# EAGLE design vw-lightcontrol (EAGLE 6.5.0)
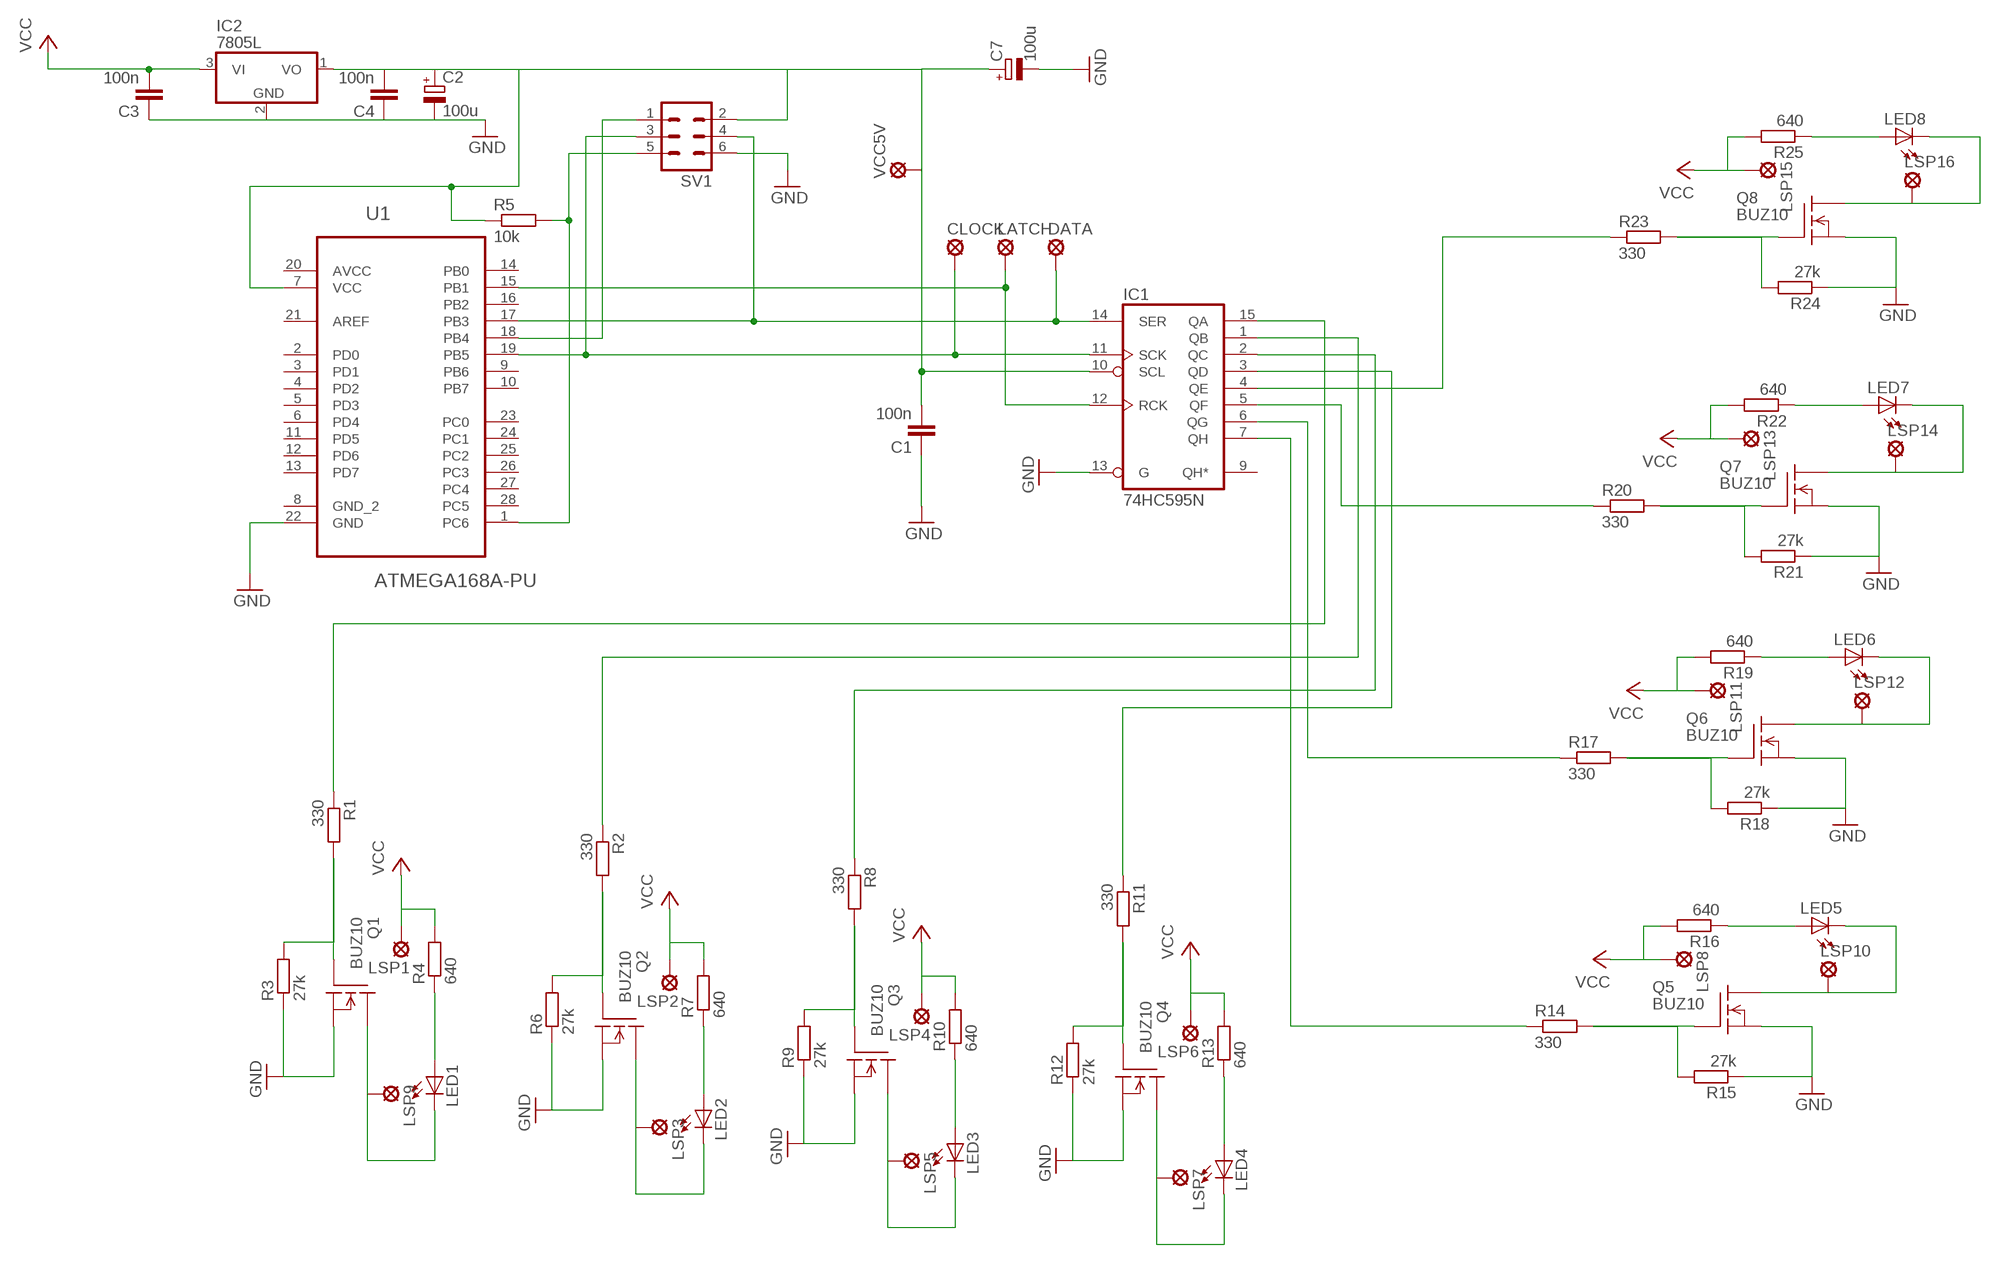
[diagram p0: schematic, sheet 1]

## Parts
C1  100n  C2.5/4  [C2.5-4]
C2  100u  CPOL-EUE2,5-6E  [E2,5-6E]
C3  100n  C2.5/4  [C2.5-4]
C4  100n  C2.5/4  [C2.5-4]
C7  100u  CPOL-EUE2,5-6E  [E2,5-6E]
CLOCK  LSP10  [LSP10]
DATA  LSP10  [LSP10]
IC1  74HC595N  [DIL16]
IC2  7805L  [TO92]
LATCH  LSP10  [LSP10]
LED1  LED3MM  [LED3MM]
LED2  LED3MM  [LED3MM]
LED3  LED3MM  [LED3MM]
LED4  LED3MM  [LED3MM]
LED5  LED3MM  [LED3MM]
LED6  LED3MM  [LED3MM]
LED7  LED3MM  [LED3MM]
LED8  LED3MM  [LED3MM]
LSP1  LSP10  [LSP10]
LSP2  LSP10  [LSP10]
LSP3  LSP10  [LSP10]
LSP4  LSP10  [LSP10]
LSP5  LSP10  [LSP10]
LSP6  LSP10  [LSP10]
LSP7  LSP10  [LSP10]
LSP8  LSP10  [LSP10]
LSP9  LSP10  [LSP10]
LSP10  LSP10  [LSP10]
LSP11  LSP10  [LSP10]
LSP12  LSP10  [LSP10]
LSP13  LSP10  [LSP10]
LSP14  LSP10  [LSP10]
LSP15  LSP10  [LSP10]
LSP16  LSP10  [LSP10]
Q1  BUZ10  [TO220]
Q2  BUZ10  [TO220]
Q3  BUZ10  [TO220]
Q4  BUZ10  [TO220]
Q5  BUZ10  [TO220]
Q6  BUZ10  [TO220]
Q7  BUZ10  [TO220]
Q8  BUZ10  [TO220]
R1  330  R-EU_0207/10  [0207/10]
R2  330  R-EU_0207/10  [0207/10]
R3  27k  R-EU_0207/10  [0207/10]
R4  640  R-EU_0207/10  [0207/10]
R5  10k  R-EU_0207/10  [0207/10]
R6  27k  R-EU_0207/10  [0207/10]
R7  640  R-EU_0207/10  [0207/10]
R8  330  R-EU_0207/10  [0207/10]
R9  27k  R-EU_0207/10  [0207/10]
R10  640  R-EU_0207/10  [0207/10]
R11  330  R-EU_0207/10  [0207/10]
R12  27k  R-EU_0207/10  [0207/10]
R13  640  R-EU_0207/10  [0207/10]
R14  330  R-EU_0207/10  [0207/10]
R15  27k  R-EU_0207/10  [0207/10]
R16  640  R-EU_0207/10  [0207/10]
R17  330  R-EU_0207/10  [0207/10]
R18  27k  R-EU_0207/10  [0207/10]
R19  640  R-EU_0207/10  [0207/10]
R20  330  R-EU_0207/10  [0207/10]
R21  27k  R-EU_0207/10  [0207/10]
R22  640  R-EU_0207/10  [0207/10]
R23  330  R-EU_0207/10  [0207/10]
R24  27k  R-EU_0207/10  [0207/10]
R25  640  R-EU_0207/10  [0207/10]
SV1  MA03-2  [MA03-2]
U1  ATMEGA168A-PU  [DIP254P762X457-28]
VCC5V  LSP10  [LSP10]

## Nets
GND: C2.- C3.1 C4.1 IC1.13(G) IC2.2(GND) Q1.3(S) Q2.3(S) Q3.3(S) Q4.3(S) Q5.3(S) Q6.3(S) Q7.3(S) Q8.3(S) R3.1 R6.1 R9.1 R12.1 R15.1 R18.1 R21.1 R24.1 SV1.6 U1.22(GND)
N$1: LED1.A R4.1
N$2: Q1.1(G) R1.2 R3.2
N$3: LED1.K(C) LSP9.MP Q1.2(D)
N$4: IC1.15(QA) R1.1
N$5: LED2.A R7.1
N$6: C3.2 IC2.3(VI) LSP1.MP LSP2.MP LSP4.MP LSP6.MP LSP8.MP LSP11.MP LSP13.MP LSP15.MP R4.2 R7.2 R10.2 R13.2 R16.2 R19.2 R22.2 R25.2 ; supply symbol labelled VCC
N$7: C1.2 C2.+ C4.2 C7.+ IC1.10(SCL) IC2.1(VO) R5.1 SV1.2 U1.7(VCC) VCC5V.MP
N$8: Q2.1(G) R2.2 R6.2
N$9: LED2.K(C) LSP3.MP Q2.2(D)
N$10: IC1.1(QB) R2.1
N$11: LED3.A R10.1
N$12: Q3.1(G) R8.2 R9.2
N$13: LED3.K(C) LSP5.MP Q3.2(D)
N$14: IC1.2(QC) R8.1
N$15: LED4.A R13.1
N$16: Q4.1(G) R11.2 R12.2
N$17: LED4.K(C) LSP7.MP Q4.2(D)
N$18: IC1.3(QD) R11.1
N$19: LED5.A R16.1
N$20: R5.2 SV1.5 U1.1(PC6)
N$21: Q5.1(G) R14.2 R15.2
N$22: DATA.MP IC1.14(SER) SV1.4 U1.17(PB3)
N$23: SV1.1 U1.18(PB4)
N$24: LED5.K(C) LSP10.MP Q5.2(D)
N$25: IC1.7(QH) R14.1
N$26: LED6.A R19.1
N$27: Q6.1(G) R17.2 R18.2
N$28: LED6.K(C) LSP12.MP Q6.2(D)
N$29: IC1.6(QG) R17.1
N$30: LED7.A R22.1
N$31: Q7.1(G) R20.2 R21.2
N$32: LED7.K(C) LSP14.MP Q7.2(D)
N$33: IC1.5(QF) R20.1
N$34: LED8.A R25.1
N$35: Q8.1(G) R23.2 R24.2
N$36: LED8.K(C) LSP16.MP Q8.2(D)
N$37: IC1.4(QE) R23.1
N$102: CLOCK.MP IC1.11(SCK) SV1.3 U1.19(PB5)
N$104: C1.1 C7.- ; supply symbol labelled GND
N$110: IC1.12(RCK) LATCH.MP U1.15(PB1)
Unconnected: IC1.9(QH*) U1.2(PD0) U1.3(PD1) U1.4(PD2) U1.5(PD3) U1.6(PD4) U1.8(GND_2) U1.9(PB6) U1.10(PB7) U1.11(PD5) U1.12(PD6) U1.13(PD7) U1.14(PB0) U1.16(PB2) U1.21(AREF) U1.23(PC0) U1.24(PC1) U1.25(PC2) U1.26(PC3) U1.27(PC4) U1.28(PC5)

## Power pins joined to a net without a drawn wire
AVCC: U1.20(AVCC)
N$6: IC1.16(VCC)
N$104: IC1.8(GND)

## Library data of the parts
C1 C3 C4 = capacitor-wima:C: CAPACITOR naming: grid - package width
C2 C7 = rcl:CPOL-EU: POLARIZED CAPACITOR, European symbol
CLOCK DATA LATCH LSP1-LSP16 VCC5V = solpad:LSP10: SOLDER PAD drill 1.0 mm, distributor Buerklin, 12H555
IC1 = 74xx-eu:74*595: 8-bit SHIFT REGISTER, output latch
IC2 = linear:78*: Positive VOLTAGE REGULATOR Source: http://cache.national.com/ds/LM/LM78L05.pdf http://www.fairchildsemi.com/ds/LM/LM7805.pdf
LED1-LED8 = led:LED: LED OSRAM: - CHIPLED LG R971, LG N971, LY N971, LG Q971, LY Q971, LO R971, LY R971 LH N974, LH R974 LS Q976, LO Q976, LY Q976 LO Q996 - Hyper CHIPLED LW Q18S LB Q993, LB Q99A, LB R99A - SideLED LS A670, LO A670, LY A670, LG A670, LP A670 LB A673, LV A673, LT A673, LW A673 LH A674 LY A675 LS A676, LA A676, LO A676, LY A676, LW A676 LS A679, LY A679, LG A679 - Hyper Micro SIDELED® LS Y876, LA Y876, LO Y876, LY Y876 LT Y87S - SmartLED LW L88C, LW L88S LB L89C, LB L89S, LG L890 LS L89K, LO L89K, LY L89K LS L896, LA L896, LO L896, LY L896 - TOPLED LS T670, LO T670, LY T670, LG T670, LP T670 LSG T670, LSP T670, LSY T670, LOP T670, LYG T670 LG T671, LOG T671, LSG T671 LB T673, LV T673, LT T673, LW T673 LH T674 LS T676, LA T676, LO T676, LY T676, LB T676, LH T676, LSB T676, LW T676 LB T67C, LV T67C, LT T67C, LS T67K, LO T67K, LY T67K, LW E67C LS E67B, LA E67B, LO E67B, LY E67B, LB E67C, LV E67C, LT E67C LW T67C LS T679, LY T679, LG T679 LS T770, LO T770, LY T770, LG T770, LP T770 LB T773, LV T773, LT T773, LW T773 LH T774 LS E675, LA E675, LY E675, LS T675 LS T776, LA T776, LO T776, LY T776, LB T776 LHGB T686 LT T68C, LB T68C - Hyper Mini TOPLED® LB M676 - Mini TOPLED Santana® LG M470 LS M47K, LO M47K, LY M47K Source: http://www.osram.convergy.de LUXEON: - LUMILED® LXK2-PW12-R00, LXK2-PW12-S00, LXK2-PW14-U00, LXK2-PW14-V00 LXK2-PM12-R00, LXK2-PM12-S00, LXK2-PM14-U00 LXK2-PE12-Q00, LXK2-PE12-R00, LXK2-PE12-S00, LXK2-PE14-T00, LXK2-PE14-U00 LXK2-PB12-K00, LXK2-PB12-L00, LXK2-PB12-M00, LXK2-PB14-N00, LXK2-PB14-P00, LXK2-PB14-Q00 LXK2-PR12-L00, LXK2-PR12-M00, LXK2-PR14-Q00, LXK2-PR14-R00 LXK2-PD12-Q00, LXK2-PD12-R00, LXK2-PD12-S00 LXK2-PH12-R00, LXK2-PH12-S00 LXK2-PL12-P00, LXK2-PL12-Q00, LXK2-PL12-R00 Source: www.luxeon.com KINGBRIGHT: KA-3528ASYC Source: www.kingbright.com
Q1-Q8 = transistor-fet:BUZ10: N-Channel Enhancement MOSFET 50V; 20A; 0,080Ohm
R1-R4 R6-R25 = rcl:R-EU_: RESISTOR, European symbol
R5 = resistor:R-EU_: RESISTOR, European symbol
SV1 = con-lstb:MA03-2: PIN HEADER; OC_FARNELL: unknown; OC_NEWARK: unknown
U1 = Atmel_By_element14_Batch_1:ATMEGA168A-PU: MCU; DESCRIPTION: MCU; MPN: ATMEGA168A-PU; OC_FARNELL: 1841605; OC_NEWARK: 12T1297; PACKAGE: DIP-28; SUPPLIER: Atmel

## Board
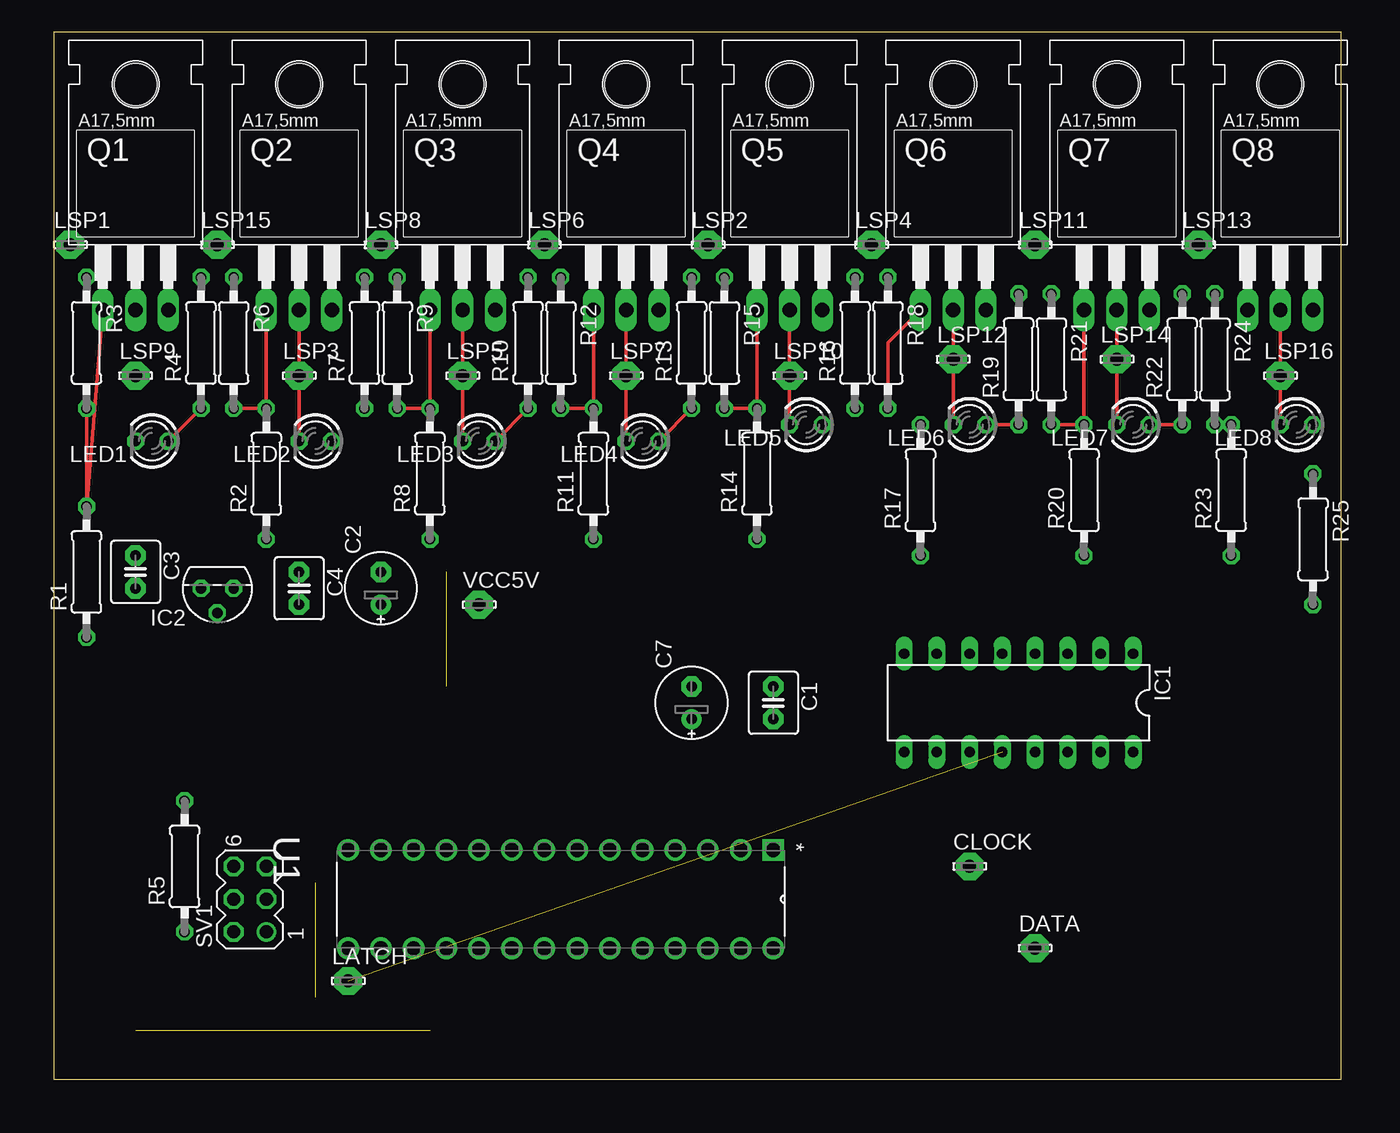
[diagram p1: board, top side]
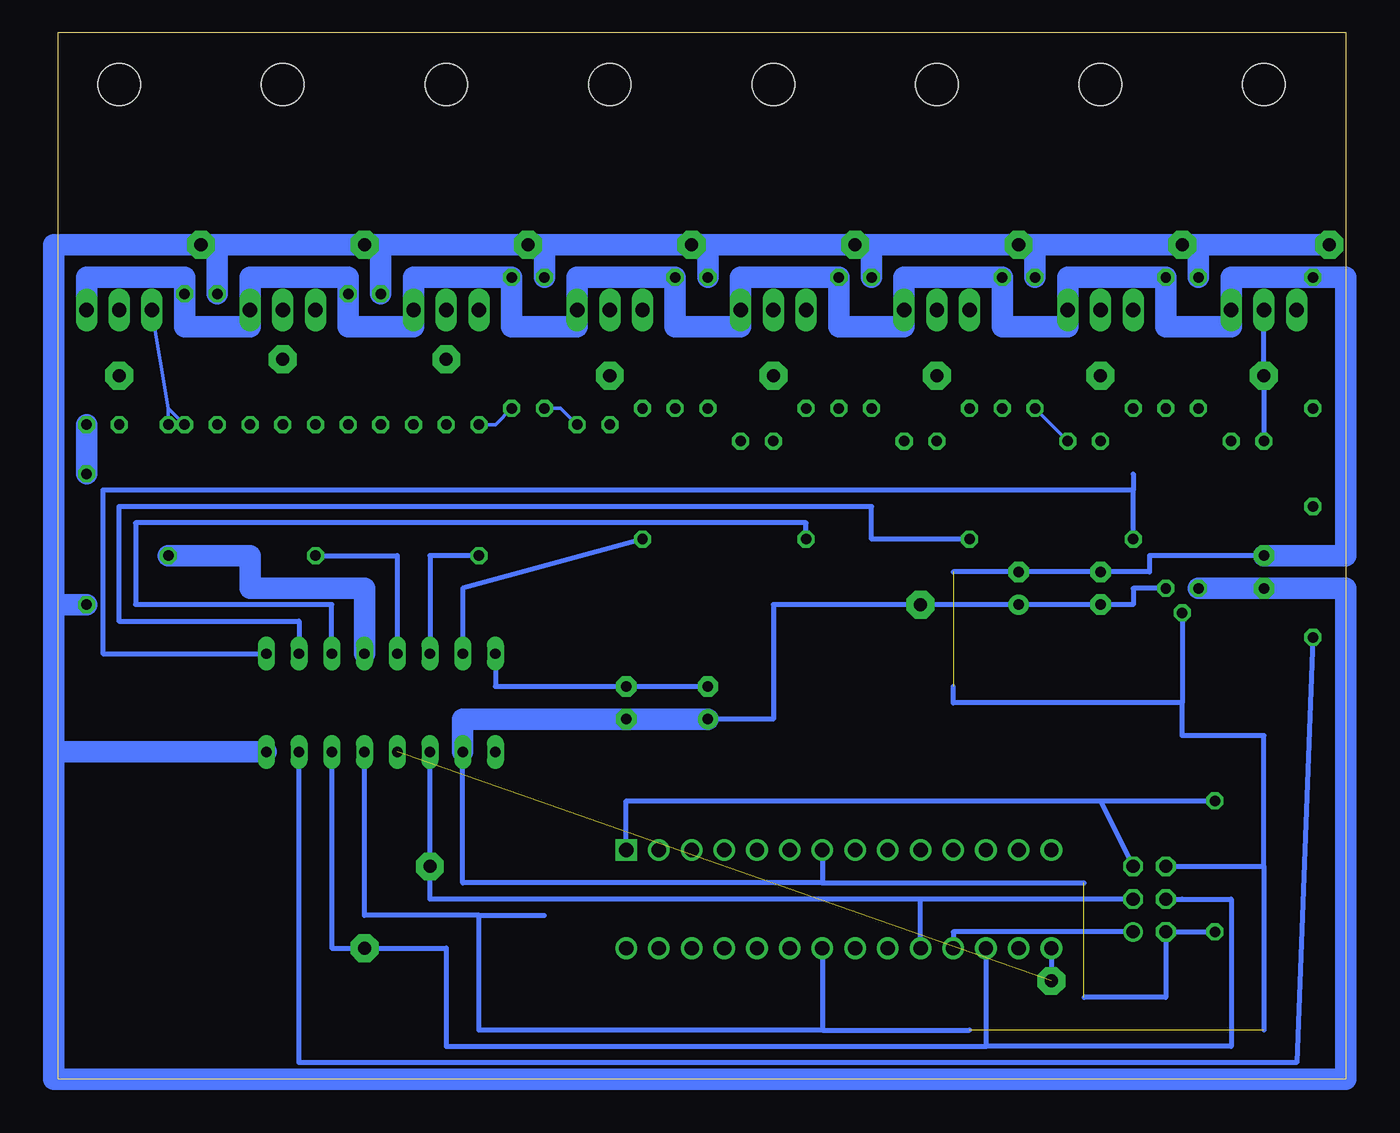
[diagram p2: board, bottom side, seen from below]

Size 100 x 81.27 mm. Coordinates in mm from the lower left corner, seen from the top.
Outline: 0,0 100,0 100,81.27 0,81.27 0,0
Copper layers (1*16): Top 0.035mm / dielectric 1.5mm / Bottom 0.035mm
Design rules "default": minimum track width 10mil, minimum drill 24mil, track to track 8mil, track to pad 8mil, pad to pad 8mil, via to via 8mil, smd to smd 8mil, copper to edge 40mil, drill to drill 8mil, minimum pad ring 10mil, minimum via ring 8mil, stop-mask expansion 4mil, vias tented up to drill 0mil, thermal gap 10mil

### Footprints (pad centres in the part's own frame; a part is rotated, then mirrored left to right if it is on the bottom)
C2.5-4 = drill 0.813 pad 1.6 octagon: 1 -1.27,0; 2 1.27,0
E2,5-6E = drill 0.813 pad 1.575: + -1.27,0 | drill 0.813 pad 1.575 octagon: - 1.27,0
LSP10 = drill 1.016 pad 2.159 octagon: MP 0,0
DIL16 = drill 0.813 long: 1 -8.89,-3.81; 2 -6.35,-3.81; 3 -3.81,-3.81; 4 -1.27,-3.81; 5 1.27,-3.81; 6 3.81,-3.81; 7 6.35,-3.81; 8 8.89,-3.81; 9 8.89,3.81; 10 6.35,3.81; 11 3.81,3.81; 12 1.27,3.81; 13 -1.27,3.81; 14 -3.81,3.81; 15 -6.35,3.81; 16 -8.89,3.81
TO92 = drill 0.813 octagon: 1 -1.27,0; 2 0,1.905; 3 1.27,0
LED3MM = drill 0.813 octagon: A -1.27,0; K 1.27,0
TO220 = drill 1.118 long: 1 -2.54,-6.35; 2 0,-6.35; 3 2.54,-6.35 | hole 3.302: 0,11.176
0207/10 = drill 0.813 octagon: 1 -5.08,0; 2 5.08,0
MA03-2 = drill 1.016: 1 -2.54,-1.27 | drill 1.016 octagon: 2 -2.54,1.27; 3 0,-1.27; 4 0,1.27; 5 2.54,-1.27; 6 2.54,1.27
DIP254P762X457-28 = drill 1.118 square: 1 -7.62,33.02 | drill 1.118: 2 -7.62,30.48; 3 -7.62,27.94; 4 -7.62,25.4; 5 -7.62,22.86; 6 -7.62,20.32; 7 -7.62,17.78; 8 -7.62,15.24; 9 -7.62,12.7; 10 -7.62,10.16; 11 -7.62,7.62; 12 -7.62,5.08; 13 -7.62,2.54; 14 -7.62,0; 15 0,0; 16 0,2.54; 17 0,5.08; 18 0,7.62; 19 0,10.16; 20 0,12.7; 21 0,15.24; 22 0,17.78; 23 0,20.32; 24 0,22.86; 25 0,25.4; 26 0,27.94; 27 0,30.48; 28 0,33.02

### Placement (x,y rotation side)
C1  55.88,29.21 270 top
C2  25.4,38.1 90 top
C3  6.35,39.37 270 top
C4  19.05,38.1 270 top
C7  49.53,29.21 90 top
CLOCK  71.12,16.51 0 top
DATA  76.2,10.16 0 top
IC1  74.93,29.21 180 top
IC2  12.7,38.1 180 top
LATCH  22.86,7.62 0 top
LED1  7.62,49.53 180 top
LED2  20.32,49.53 180 top
LED3  33.02,49.53 180 top
LED4  45.72,49.53 180 top
LED5  58.42,50.8 180 top
LED6  71.12,50.8 180 top
LED7  83.82,50.8 180 top
LED8  96.52,50.8 180 top
LSP1  1.27,64.77 0 top
LSP2  50.8,64.77 0 top
LSP3  19.05,54.61 0 top
LSP4  63.5,64.77 0 top
LSP5  31.75,54.61 0 top
LSP6  38.1,64.77 0 top
LSP7  44.45,54.61 0 top
LSP8  25.4,64.77 0 top
LSP9  6.35,54.61 0 top
LSP10  57.15,54.61 0 top
LSP11  76.2,64.77 0 top
LSP12  69.85,55.88 0 top
LSP13  88.9,64.77 0 top
LSP14  82.55,55.88 0 top
LSP15  12.7,64.77 0 top
LSP16  95.25,54.61 0 top
Q1  6.35,66.04 0 top
Q2  19.05,66.04 0 top
Q3  31.75,66.04 0 top
Q4  44.45,66.04 0 top
Q5  57.15,66.04 0 top
Q6  69.85,66.04 0 top
Q7  82.55,66.04 0 top
Q8  95.25,66.04 0 top
R1  2.54,39.37 90 top
R2  16.51,46.99 90 top
R3  2.54,57.15 270 top
R4  11.43,57.15 90 top
R5  10.16,16.51 90 top
R6  13.97,57.15 270 top
R7  24.13,57.15 90 top
R8  29.21,46.99 90 top
R9  26.67,57.15 270 top
R10  36.83,57.15 90 top
R11  41.91,46.99 90 top
R12  39.37,57.15 270 top
R13  49.53,57.15 90 top
R14  54.61,46.99 90 top
R15  52.07,57.15 270 top
R16  62.23,57.15 90 top
R17  67.31,45.72 90 top
R18  64.77,57.15 270 top
R19  74.93,55.88 90 top
R20  80.01,45.72 90 top
R21  77.47,55.88 270 top
R22  87.63,55.88 90 top
R23  91.44,45.72 90 top
R24  90.17,55.88 270 top
R25  97.79,41.91 270 top
SV1  15.24,13.97 90 top
U1  22.86,10.16 270 top
VCC5V  33.02,36.83 0 top

### Tracks (layer width: path | path; a pad name or v marks a point on that pad's centre or on a via)
GND  (2 unrouted)
  Bottom 0.406: 40.64,3.81 67.31,3.81 67.31,12.7 | 67.31,12.7 76.2,12.7 IC1.13 | U1.22 40.64,3.81 | 40.64,3.81 29.21,3.81 | C3.1 15.24,40.64 15.24,39.37 C4.1 C2.- 30.48,39.37 | 67.31,12.7 62.23,12.7 | 6.35,16.51 6.35,26.67 12.7,26.67 12.7,29.21 | SV1.6 6.35,16.51 | 6.35,16.51 6.35,3.81 | IC2.2 12.7,29.21 | 12.7,29.21 30.48,29.21 30.48,30.48
  Bottom 1.676: Q8.3 97.79,62.23 90.17,62.23 R24.1 90.17,58.42 85.09,58.42 Q7.3 85.09,62.23 77.47,62.23 R21.1 77.47,58.42 72.39,58.42 Q6.3 72.39,62.23 R18.1 64.77,58.42 59.69,58.42 Q5.3 59.69,62.23 R15.1 52.07,58.42 46.99,58.42 Q4.3 46.99,62.23 R12.1 39.37,58.42 34.29,58.42 Q3.3 34.29,62.23 R9.1 26.67,58.42 21.59,58.42 Q2.3 21.59,62.23 R6.1 13.97,58.42 8.89,58.42 Q1.3 8.89,62.23 R3.1 0,62.23 0,40.64 C3.1
N$1
  Top 0.254: R4.1 LED1.A
N$2
  Top 0.254: R3.2 R1.2 Q1.1
N$3
  Bottom 0.406: LED1.K LSP9.MP Q1.2
N$4
  Bottom 0.406: R1.1 3.81,1.27 81.28,1.27 IC1.15
N$5
  Bottom 0.254: R7.1 LED2.A
N$6
  Bottom 1.676: LSP1.MP LSP15.MP | LSP15.MP LSP8.MP | LSP8.MP LSP6.MP | LSP6.MP LSP2.MP | LSP2.MP LSP4.MP | LSP4.MP LSP11.MP | LSP11.MP LSP13.MP | LSP13.MP 100.33,64.77 100.33,36.83 | LSP15.MP 11.43,64.77 R4.2 | LSP8.MP 24.13,64.77 R7.2 | LSP6.MP 36.83,64.77 R10.2 | LSP2.MP 49.53,64.77 R13.2 | LSP4.MP 62.23,64.77 R16.2 | LSP11.MP 74.93,64.77 R19.2 | LSP13.MP 87.63,64.77 R22.2 | 100.33,36.83 100.33,25.4 | 100.33,25.4 100.33,0 0,0 0,38.1 C3.2 IC2.3 | R25.2 100.33,36.83 | IC1.16 100.33,25.4
N$7  (1 unrouted)
  Bottom 0.406: C7.+ 44.45,27.94 44.45,36.83 VCC5V.MP C2.+ C4.2 16.51,36.83 16.51,38.1 IC2.1 | U1.7 40.64,15.24 | 40.64,15.24 68.58,15.24 IC1.10 | R5.1 SV1.2 13.97,6.35 20.32,6.35 | 40.64,15.24 20.32,15.24
  Bottom 1.676: IC1.10 68.58,27.94 C1.2 C7.+
N$8
  Top 0.254: R6.2 R2.2 Q2.1
N$9
  Top 0.254: LED2.K LSP3.MP Q2.2
N$10
  Bottom 0.406: R2.1 16.51,45.72 | 16.51,46.99 16.51,45.72 | 16.51,45.72 96.52,45.72 96.52,33.02 IC1.1
N$11
  Top 0.254: R10.1 LED3.A
N$12
  Top 0.254: R9.2 R8.2 Q3.1
N$13
  Top 0.254: LED3.K LSP5.MP Q3.2
N$14
  Bottom 0.406: R8.1 36.83,41.91 36.83,44.45 95.25,44.45 95.25,35.56 81.28,35.56 IC1.2
N$15
  Top 0.254: R13.1 LED4.A
N$16
  Top 0.254: R12.2 R11.2 Q4.1
N$17
  Top 0.254: LED4.K LSP7.MP Q4.2
N$18
  Bottom 0.406: R11.1 41.91,43.18 93.98,43.18 93.98,36.83 78.74,36.83 IC1.3
N$19
  Bottom 0.254: LED5.A 60.96,52.07 R16.1
N$20
  Bottom 0.406: U1.1 55.88,21.59 19.05,21.59 | 19.05,21.59 R5.2 | SV1.5 19.05,21.59
N$21
  Top 0.254: R15.2 R14.2 Q5.1
N$22
  Bottom 0.406: 27.94,2.54 69.85,2.54 69.85,10.16 DATA.MP 78.74,10.16 IC1.14 | 12.7,13.97 SV1.4 8.89,13.97 8.89,2.54 27.94,2.54 | U1.17 27.94,2.54
N$23
  Bottom 0.406: SV1.1 30.48,11.43 U1.18
N$24
  Top 0.254: LED5.K LSP10.MP Q5.2
N$25
  Bottom 0.406: R14.1 68.58,38.1 IC1.7
N$26
  Top 0.254: R19.1 LED6.A
N$27
  Top 0.254: Q6.1 64.77,57.15 R18.2
  Bottom 0.254: R18.2 66.04,50.8 R17.2
N$28
  Top 0.254: LED6.K LSP12.MP Q6.2
N$29
  Bottom 0.406: R17.1 71.12,40.64 IC1.6
N$30
  Top 0.254: R22.1 LED7.A
N$31
  Top 0.254: R21.2 R20.2 Q7.1
N$32
  Top 0.254: LED7.K LSP14.MP Q7.2
N$33
  Bottom 0.406: R20.1 73.66,40.64 IC1.5
N$34
  Bottom 1.676: R25.1 LED8.A
N$35
  Bottom 0.254: 91.44,52.07 R24.2 | R23.2 91.44,52.07 | 91.44,52.07 Q8.1
N$36
  Top 0.254: LED8.K LSP16.MP Q8.2
N$37
  Bottom 1.676: IC1.4 76.2,38.1 85.09,38.1 85.09,40.64 R23.1
N$102
  Bottom 0.406: IC1.11 CLOCK.MP 71.12,13.97 33.02,13.97 | SV1.3 33.02,13.97 | U1.19 33.02,13.97
N$104
  Bottom 0.406: IC1.8 66.04,30.48 C1.1 C7.-
N$110  (1 unrouted)
  Bottom 0.406: U1.15 LATCH.MP